# Altium schematic sheet Э3.SchDoc: Блок питания
size 209 x 297 mm; CheckedBy: Бойков; Author: Антонов; Address1: Address1; Address2: Address2; Address3: Address3; Address4: Address4; DocumentNumber: МРАГ.43 1122.400 Э3; SheetNumber: 1; SheetTotal: 1; DocumentType: Схема электрическая принципиальная; FirstReferrence: МРАГ.43 1122.400 Э3
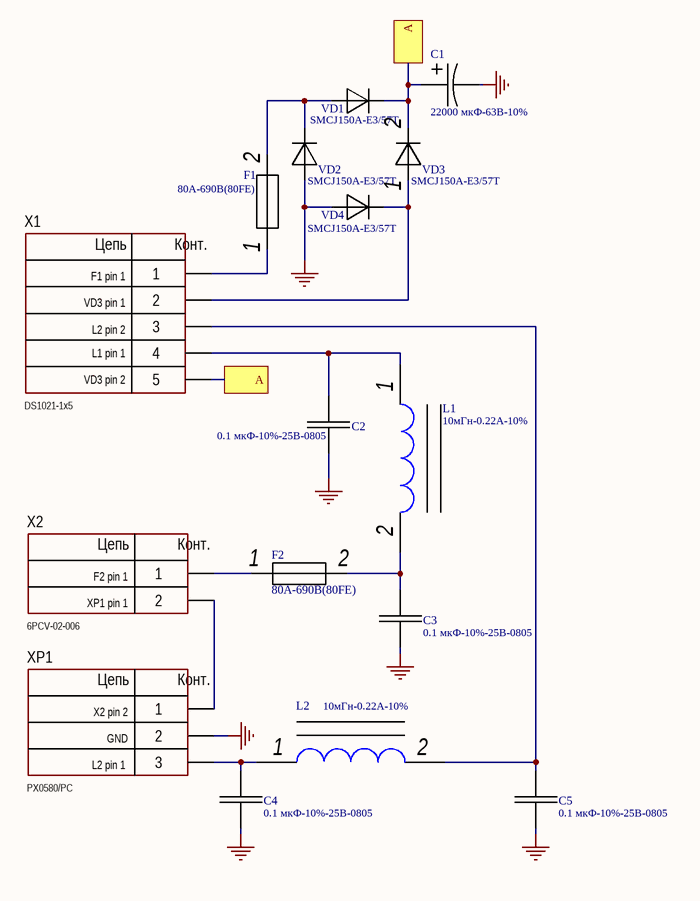
[diagram p0: Э3.SchDoc]

## Parts
C1  22000 мкФ-63В-10%  [condpolar]
C2  0.1 мкФ-10%-25В-0805  [Condensator]
C3  0.1 мкФ-10%-25В-0805  [Condensator]
C4  0.1 мкФ-10%-25В-0805  [Condensator]
C5  0.1 мкФ-10%-25В-0805  [Condensator]
F1  80А-690В(80FE)  [FUSE 80]
F2  80А-690В(80FE)  [FUSE 80]
L1  10мГн-0.22A-10%  [inductor]
L2  10мГн-0.22A-10%  [inductor]
VD1  SMCJ150A-E3/57T  [DIOD]
VD2  SMCJ150A-E3/57T  [DIOD]
VD3  SMCJ150A-E3/57T  [DIOD]
VD4  SMCJ150A-E3/57T  [DIOD]
X1  CommentText: DS1021-1x5  [CON: PLS-5]
X2  CommentText: 6PCV-02-006  [CON: 6PCV-02-006]
XP1  CommentText: PX0580/PC  [AC]

## Ports
A

## Nets
NetC1_1: C1.1 C2.1 C3.1 C4.2 C5.1 VD2.1 VD4.1 XP1.2
A: C1.2 VD1.2 VD3.2 X1.5 ; port A
NetC2_2: C2.2 L1.1 X1.4
NetC3_2: C3.2 F2.2 L1.2
NetC4_1: C4.1 L2.1 XP1.3
NetC5_2: C5.2 L2.2 X1.3
NetF1_1: F1.1 X1.1
NetF1_2: F1.2 VD1.1 VD2.2
NetF2_1: F2.1 X2.1
NetVD3_1: VD3.1 VD4.2 X1.2
NetX2_2: X2.2 XP1.1

## Notes on the sheet
- VD3 pin 1
- F1 pin 1
- L1 pin 1
- L2 pin 2
- VD3 pin 2
- F2 pin 1
- XP1 pin 1
- X2 pin 2
- L2 pin 1
- GND
- Перв. примен.
- Справ. №
- Подп. и дата
- Инв. № дубл.
- Взам. инв. №
- Разраб.
- Изм.
- Лист
- № докум.
- Подп.
- Дата
- Литера
- Масса
- Масштаб
- Пров.
- Т.контр.
- Листов
- Инв. № подл.
- Н.контр.
- Утв.
- Форма 1 ГОСТ 2.104-2006
- Копировал
- Формат А4
- (in symbol Connector_6PCV-02) Цепь; Конт.
- (in symbol PLS-5) Цепь; Конт.
- (in symbol WF-3) Цепь; Конт.

## Library data of the parts
C1 = конденсатор_поляр: Manufacturer: Тайвань; PartNumber: ECAP22000uF/63V,85°C; Kind: Конденсатор полярный; Href: https://www.chipdip.ru/product0/52234
C2-C5 = конденсатор: Manufacturer: Murata Electronics; PartNumber: GRM21BR71E104KA01L; Href: https://www.chipdip.ru/product/grm21br71e104ka01l
  C2: Kind: конденсатор
  C3-C5: kind: конденсатор
F1 F2 = FUSE: Manufacturer: Eaton; Kind: Дроссель; Href: https://www.chipdip.ru/product0/8007032559; PartNumber: 80FE
L1 = inductor: Manufacturer: Kemet Electronics; PartNumber: SBC6-103-161; Kind: Дроссель; Href: https://www.chipdip.ru/product0/8008421775
L2 = inductor: Manufacturer: Kemet Electronics; Kind: Дроссель; PurtNumber: SBC6-103-161; Href: https://www.chipdip.ru/product0/8008421775
VD1 VD3 VD4 = Diod: Manufacturer: VISHAY INTERTECHNOLOGY INC.; Kind: Диод; Href: https://www.chipdip.ru/product0/8612399438
  VD1: Partnumber: SMCJ150A-E3/57T
  VD3: PurtNumber: SMCJ150A-E3/57T
  VD4: PartNumber: SMCJ150A-E3/57T
VD2 = Diod: Manufacturer: VISHAY INTERTECHNOLOGY INC.; Kind: диод; Href: https://www.chipdip.ru/product0/8612399438; PartNumber: SMCJ150A-E3/57T
X1 = PLS-5: Manufacturer: Connfly; ValueManufacturerPartNumber: Connector, 5pin, 2.54mm, 500VAC, 3A; TypeConnector: Connector; VoltageMax: 500VAC; Pitch: 2.54mm; CurrentMax: 3A; Multichannel: 5pin; HelpURL: https://www.chipdip.ru/product/pls-5; PartNumber: PLS-5
X2 = Connector_6PCV-02: Manufacturer: TE Connectivity; ValueManufacturerPartNumber: Connector, 2pin, 9.53mm, 300VAC, 25A; VoltageMax: 300VAC; Pitch: 9.53mm; CurrentMax: 25A; Multichannel: 2pin; HelpURL: https://www.digikey.com/products/en?keywords=6PCV-02-006; TypeConnector: Connector; PartNumber: 6PCV-02-006
XP1 = WF-3: Manufacturer: Connfly; ValueManufacturerPartNumber: Connector, 3pin, 2.54mm, 250VAC, 3A; TypeConnector: Connector; VoltageMax: 250VAC; Pitch: 2.54mm; CurrentMax: 3A; Multichannel: 3pin; HelpURL: https://www.chipdip.ru/product/wf-3; PartNumber: WF-3